# EAGLE design PillEndo-MkI_MAIN5 (EAGLE 6.5.0)
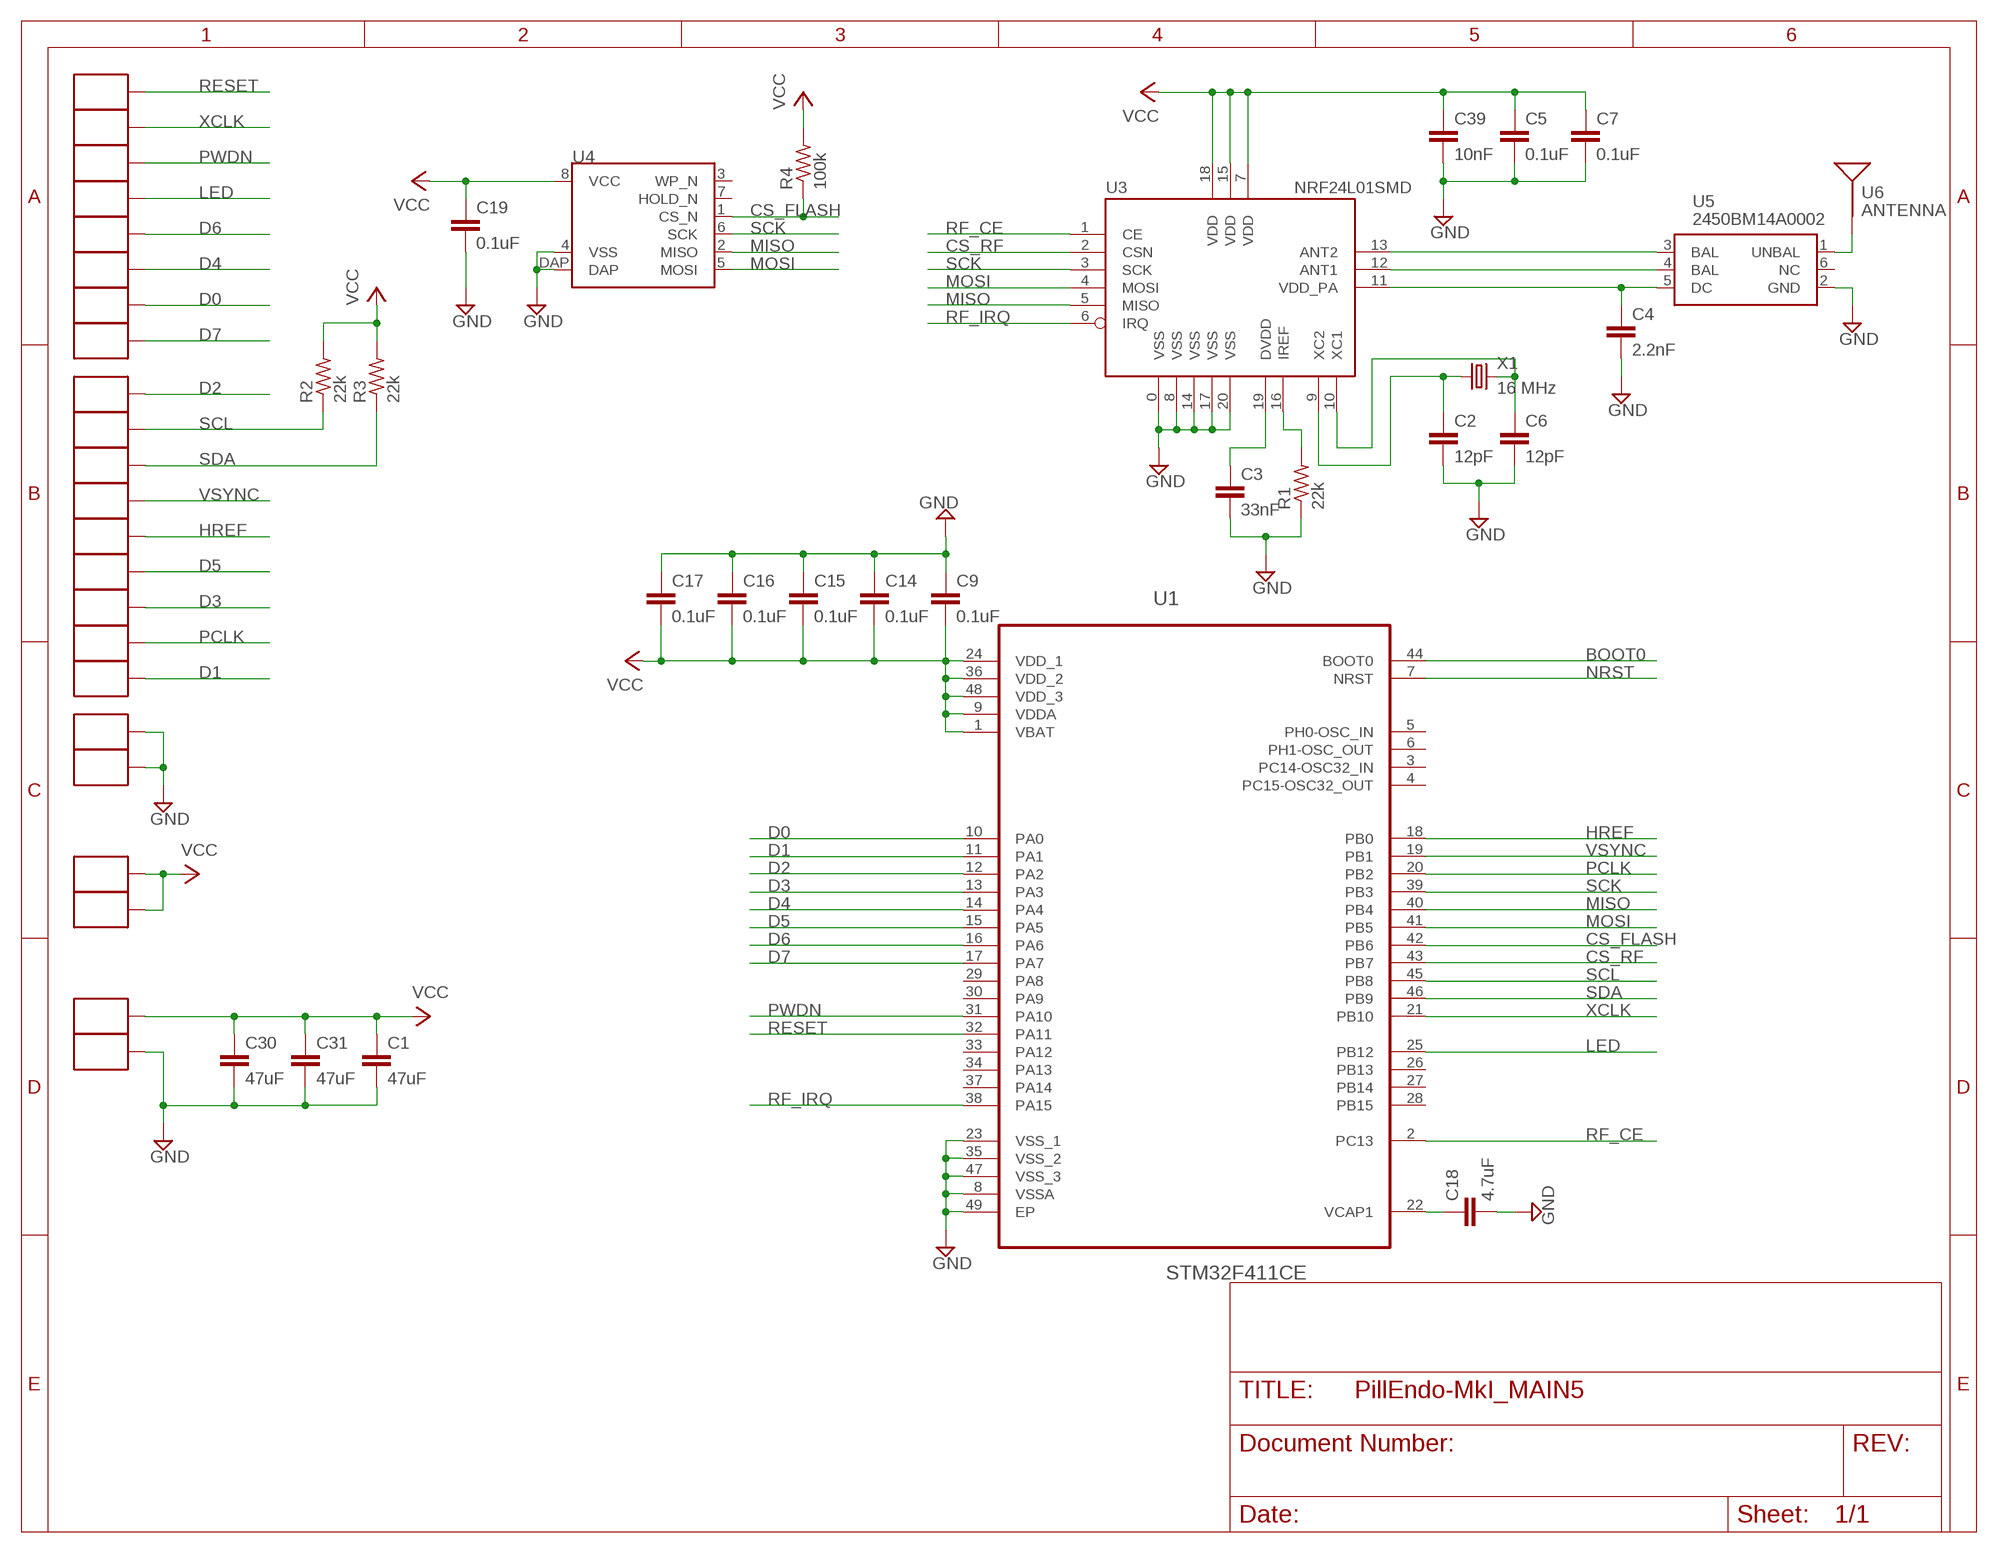
[diagram p0: schematic, sheet 1]

## Parts
C1  47uF  C0603  [C0603]
C2  12pF  C0402  [C0402]
C3  33nF  C0402  [C0402]
C4  2.2nF  C0402  [C0402]
C5  0.1uF  C0402  [C0402]
C6  12pF  C0402  [C0402]
C7  0.1uF  C0402  [C0402]
C9  0.1uF  C0402  [C0402]
C14  0.1uF  C0402  [C0402]
C15  0.1uF  C0402  [C0402]
C16  0.1uF  C0402  [C0402]
C17  0.1uF  C0402  [C0402]
C18  4.7uF  C0402  [C0402]
C19  0.1uF  C0402  [C0402]
C30  47uF  C0603  [C0603]
C31  47uF  C0603  [C0603]
C39  10nF  C0402  [C0402]
R1  22k  R0402  [R0402]
R2  22k  R0402  [R0402]
R3  22k  R0402  [R0402]
R4  100k  R0402  [R0402]
TP1  TP_0.8X1.2  [TP_0.8X1.2]
TP2  TP_0.8X1.2  [TP_0.8X1.2]
TP3  TP_0.8X1.2  [TP_0.8X1.2]
TP4  TP_0.8X1.2  [TP_0.8X1.2]
TP5  TP_0.8X1.2  [TP_0.8X1.2]
TP6  TP_0.8X1.2  [TP_0.8X1.2]
TP7  TP_0.8X1.2  [TP_0.8X1.2]
TP8  TP_0.8X1.2  [TP_0.8X1.2]
TP9  TP_0.8X1.2  [TP_0.8X1.2]
TP10  TP_TP1.0X2.2  [TP_1.0X2.2]
TP11  TP_0.8X1.2  [TP_0.8X1.2]
TP12  TP_TP1.0X2.2  [TP_1.0X2.2]
TP13  TP_0.8X1.2  [TP_0.8X1.2]
TP14  TP_0.8X1.2  [TP_0.8X1.2]
TP15  TP_0.8X1.2  [TP_0.8X1.2]
TP16  TP_0.8X1.2  [TP_0.8X1.2]
TP17  TP_TP1.0X2.2  [TP_1.0X2.2]
TP18  TP_TP1.0X2.2  [TP_1.0X2.2]
TP19  TP_TP1.0X2.2  [TP_1.0X2.2]
TP20  TP_TP1.0X2.2  [TP_1.0X2.2]
TP33  TP_0.8X1.2  [TP_0.8X1.2]
TP34  TP_0.8X1.2  [TP_0.8X1.2]
TP35  TP_0.8X1.2  [TP_0.8X1.2]
U1  STM32F411CE  [QFN50P700X700X60-49N]
U3  NRF24L01SMD  [QFN20]
U4  S25FL256S  [WSON_6X8]
U5  2450BM14A0002  [2450BM14A0002T]
U6  ANTENNA  [2450AT18A100]
X1  16 MHz  CRYSTAL_FA-20H  [CRYSTAL_FA20H]

## Nets
BOOT0: U1.44(BOOT0)
CS_FLASH: R4.1 U1.42(PB6) U4.1(CS_N)
CS_RF: U1.43(PB7) U3.2(CSN)
D0: TP7.P$1 U1.10(PA0)
D1: TP34.P$1 U1.11(PA1)
D2: TP9.P$1 U1.12(PA2)
D3: TP16.P$1 U1.13(PA3)
D4: TP6.P$1 U1.14(PA4)
D5: TP15.P$1 U1.15(PA5)
D6: TP5.P$1 U1.16(PA6)
D7: TP8.P$1 U1.17(PA7)
GND: C1.2 C2.2 C3.2 C4.2 C5.2 C6.2 C7.2 C9.1 C14.1 C15.1 C16.1 C17.1 C18.2 C19.2 C30.2 C31.2 C39.2 R1.1 TP10.P$1 TP12.P$1 TP17.P$1 U1.8(VSSA) U1.23(VSS_1) U1.35(VSS_2) U1.47(VSS_3) U1.49(EP) U3.0(VSS) U3.8(VSS) U3.14(VSS) U3.17(VSS) U3.20(VSS) U4.4(VSS) U4.DAP U5.2(GND)
HREF: TP14.P$1 U1.18(PB0)
LED: TP4.P$1 U1.25(PB12)
MISO: U1.40(PB4) U3.5(MISO) U4.2(MISO)
MOSI: U1.41(PB5) U3.4(MOSI) U4.5(MOSI)
N$1: C3.1 U3.19(DVDD)
N$2: C2.1 U3.9(XC2) X1.1
N$3: C6.1 U3.10(XC1) X1.3
N$4: R1.2 U3.16(IREF)
N$7: C4.1 U3.11(VDD_PA) U5.5(DC)
N$8: U3.12(ANT1) U5.4(BAL)
N$9: U3.13(ANT2) U5.3(BAL)
N$10: U5.1(UNBAL) U6.1(SIGNAL)
N$11: C18.1 U1.22(VCAP1)
NRST: U1.7(NRST)
PCLK: TP33.P$1 U1.20(PB2)
PWDN: TP3.P$1 U1.31(PA10)
RESET: TP1.P$1 U1.32(PA11)
RF_CE: U1.2(PC13) U3.1(CE)
RF_IRQ: U1.38(PA15) U3.6(IRQ)
SCK: U1.39(PB3) U3.3(SCK) U4.6(SCK)
SCL: R2.1 TP11.P$1 U1.45(PB8)
SDA: R3.1 TP35.P$1 U1.46(PB9)
VCC: C1.1 C5.1 C7.1 C9.2 C14.2 C15.2 C16.2 C17.2 C19.1 C30.1 C31.1 C39.1 R2.2 R3.2 R4.2 TP18.P$1 TP19.P$1 TP20.P$1 U1.1(VBAT) U1.9(VDDA) U1.24(VDD_1) U1.36(VDD_2) U1.48(VDD_3) U3.7(VDD) U3.15(VDD) U3.18(VDD) U4.8(VCC)
VSYNC: TP13.P$1 U1.19(PB1)
XCLK: TP2.P$1 U1.21(PB10)
Unconnected: U1.3(PC14-OSC32_IN) U1.4(PC15-OSC32_OUT) U1.5(PH0-OSC_IN) U1.6(PH1-OSC_OUT) U1.26(PB13) U1.27(PB14) U1.28(PB15) U1.29(PA8) U1.30(PA9) U1.33(PA12) U1.34(PA13) U1.37(PA14) U4.3(WP_N) U4.7(HOLD_N) U5.6(NC)

## Library data of the parts
C1 C30 C31 = MSSRP-Lib:C0603
C2-C7 C9 C14-C19 C39 = MSSRP-Lib:C0402
R1-R4 = MSSRP-Lib:R0402
TP1-TP20 TP33-TP35 = MSSRP-Lib:TP
U1 = ST Microelctronics_By_element14_Batch_1:STM32F411CE
U3 = SparkFun-RF:NRF24L01: 2.4GHz Low Power Transceiver This is the very popular, low cost, very low power RF transceiver from Nordic Semiconductor. Simple SPI interface. SKU: COM-00690
U4 = MSSRP-Lib:S25FL256S
U5 = MSSRP-Lib:2450BM14A0002
U6 = RB-MasterLib:ANTENNA
X1 = MSSRP-Lib:CRYSTAL_FA-20H

## Board
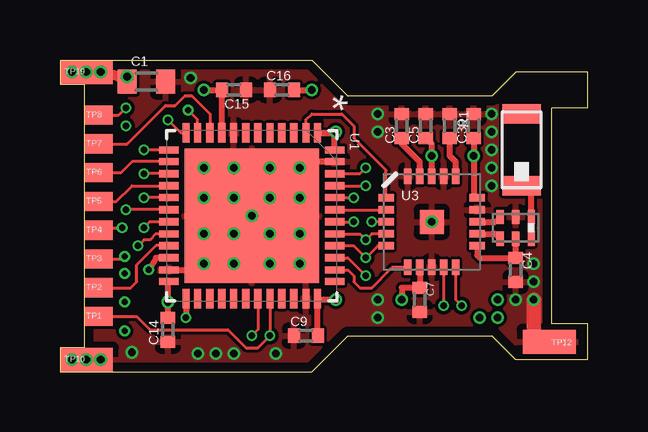
[diagram p1: board, top side]
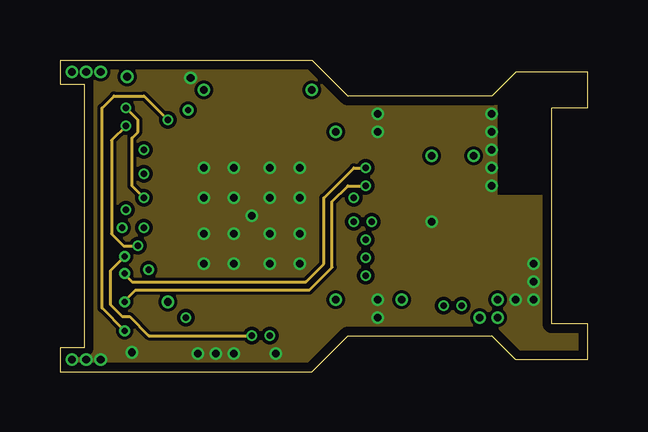
[diagram p2: board, inner layer Route2]
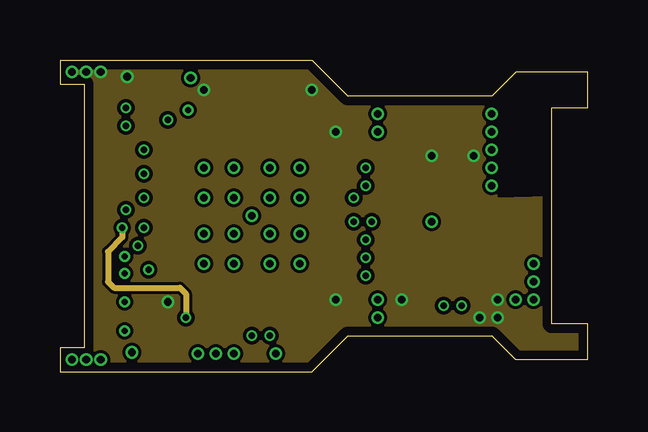
[diagram p3: board, inner layer Route15]
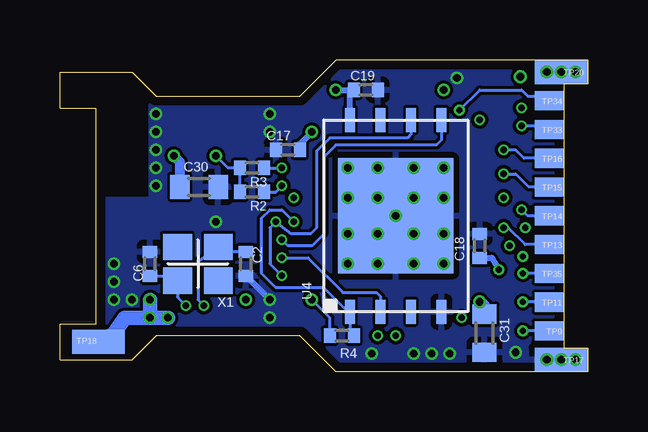
[diagram p4: board, bottom side, seen from below]

Size 22 x 13 mm. Coordinates in mm from the lower left corner, seen from the top.
Outline: 12,1.5 18,1.5 19,0.5 22,0.5 22,2 20.5,2 20.5,11 22,11 22,12.5 19,12.5 18,11.5 12,11.5 10.5,13 0,13 0,12 1,12 1,1 0,1 0,0 10.5,0 12,1.5
Copper layers (1*2*15*16): Top 0.035559375mm / dielectric 0.17018125mm / Route2 0.01778125mm / dielectric 47mil / Route15 0.01778125mm / dielectric 0.17018125mm / Bottom 0.035559375mm
Design rules "OSHPark-4layer": minimum track width 5mil, minimum drill 10mil, track to track 5mil, track to pad 5mil, pad to pad 5mil, via to via 5mil, smd to smd 5mil, copper to edge 15mil, drill to drill 6mil, minimum pad ring 4mil, minimum via ring 4mil, stop-mask expansion 4mil, vias tented up to drill 0mil, thermal gap 10mil

### Footprints (pad centres in the part's own frame; a part is rotated, then mirrored left to right if it is on the bottom)
C0603 = smd 0.8 x 1: 1 -0.8,0; 2 0.8,0
C0402 = smd 0.5 x 0.6: 1 -0.5,0; 2 0.5,0
R0402 = smd 0.5 x 0.6: 1 -0.5,0; 2 0.5,0
TP_0.8X1.2 = smd 1.2 x 0.8: P$1 -0.6,0
TP_1.0X2.2 = smd 2.2 x 1: P$1 -1.1,0
QFN50P700X700X60-49N = smd 0.813 x 0.305: 1 -3.454,2.743; 2 -3.454,2.261; 3 -3.454,1.753; 4 -3.454,1.245; 5 -3.454,0.762; 6 -3.454,0.254; 7 -3.454,-0.254; 8 -3.454,-0.762; 9 -3.454,-1.245; 10 -3.454,-1.753; 11 -3.454,-2.261; 12 -3.454,-2.743; 25 3.454,-2.743; 26 3.454,-2.261; 27 3.454,-1.753; 28 3.454,-1.245; 29 3.454,-0.762; 30 3.454,-0.254; 31 3.454,0.254; 32 3.454,0.762; 33 3.454,1.245; 34 3.454,1.753; 35 3.454,2.261; 36 3.454,2.743 | smd 0.305 x 0.813: 13 -2.743,-3.454; 14 -2.261,-3.454; 15 -1.753,-3.454; 16 -1.245,-3.454; 17 -0.762,-3.454; 18 -0.254,-3.454; 19 0.254,-3.454; 20 0.762,-3.454; 21 1.245,-3.454; 22 1.753,-3.454; 23 2.261,-3.454; 24 2.743,-3.454; 37 2.743,3.454; 38 2.261,3.454; 39 1.753,3.454; 40 1.245,3.454; 41 0.762,3.454; 42 0.254,3.454; 43 -0.254,3.454; 44 -0.762,3.454; 45 -1.245,3.454; 46 -1.753,3.454; 47 -2.261,3.454; 48 -2.743,3.454 | smd 5.588 x 5.588: 49 0,0
QFN20 = smd 1 x 1: 0 0,0 | smd 0.65 x 0.3: 1 -1.9,1; 2 -1.9,0.5; 3 -1.9,0; 4 -1.9,-0.5; 5 -1.9,-1; 11 1.9,-1; 12 1.9,-0.5; 13 1.9,0; 14 1.9,0.5; 15 1.9,1 | smd 0.3 x 0.65: 6 -1,-1.9; 7 -0.5,-1.9; 8 0,-1.9; 9 0.5,-1.9; 10 1,-1.9; 16 1,1.9; 17 0.5,1.9; 18 0,1.9; 19 -0.5,1.9; 20 -1,1.9
WSON_6X8 = smd 0.4 x 1: 1 -1.905,-4; 2 -0.635,-4; 3 0.635,-4; 4 1.905,-4; 5 1.905,4; 6 0.635,4; 7 -0.635,4; 8 -1.905,4 | smd 4.8 x 4.8: DAP 0,0
2450BM14A0002T = smd 0.3 x 0.6: 1 -0.65,-0.45; 2 0,-0.45; 3 0.65,-0.45; 4 0.65,0.45; 5 0,0.45; 6 -0.65,0.45
2450AT18A100 = smd 0.8 x 1.6: 1 -1.5,0; 2 1.5,0
CRYSTAL_FA20H = smd 1.2 x 1.1: 1 -0.85,-0.7; 2 0.85,-0.7; 3 0.85,0.7; 4 -0.85,0.7

### Placement (x,y rotation side)
C1  3.6,12.1 0 top
C2  14.25,4.5 270 bottom
C3  14.25,10.25 90 top
C4  19,4.25 270 top
C5  15.25,10.25 90 top
C6  18.25,4.5 90 bottom
C7  15,3 270 top
C9  10.25,1.5 0 top
C14  4.5,1.75 90 top
C15  7.25,11.75 180 top
C16  9.25,11.75 0 top
C17  12.5,9.25 0 bottom
C18  4.5,5.25 90 bottom
C19  9.25,11.75 0 bottom
C30  16.2,7.7 0 bottom
C31  4.3,1.6 270 bottom
C39  17.25,10.25 90 top
R1  16.25,10.25 270 top
R2  14,7.5 180 bottom
R3  14,8.5 180 bottom
R4  10.25,1.5 180 bottom
TP1  1,2.3 180 top
TP2  1,3.5 180 top
TP3  1,4.7 180 top
TP4  1,5.9 180 top
TP5  1,7.1 180 top
TP6  1,8.3 180 top
TP7  1,9.5 180 top
TP8  1,10.7 180 top
TP9  1,1.7 0 bottom
TP10  0,0.5 180 top
TP11  1,2.9 0 bottom
TP12  21.5,1.25 0 top
TP13  1,5.3 0 bottom
TP14  1,6.5 0 bottom
TP15  1,7.7 0 bottom
TP16  1,8.9 0 bottom
TP17  0,0.5 0 bottom
TP18  21.5,1.25 180 bottom
TP19  0,12.5 180 top
TP20  0,12.5 0 bottom
TP33  1,10.1 0 bottom
TP34  1,11.3 0 bottom
TP35  1,4.1 0 bottom
U1  8,6.5 270 top
U3  15.5,6.25 0 top
U4  8,6.5 0 bottom
U5  19,6 180 top
U6  19.25,9.25 90 top
X1  16.25,4.5 180 bottom

### Tracks (layer width: path | path; a pad name or v marks a point on that pad's centre or on a via)
BOOT0  (via drill 0.25)
  Top 0.127: U1.44 12.24,7.26 v12.25,7.25
CS_FLASH  (via drill 0.25)
  Top 0.127: U1.42 v12.25,6.25
  Bottom 0.127: v12.25,6.25 12.75,6.75 13.25,6.75 13.6,6.4 13.6,4.1 13,3.5 11,3.5 10,2.5 U4.1 9.9,1.66 R4.1
CS_RF
  Top 0.127: U1.43 U3.2
D0
  Top 0.127: TP7.P$1 2.8,9.5 4.4,11.1 4.8,11.1 5.2,11.5 5.5,11.5 6.25,10.75 U1.10
D1  (via drill 0.25)
  Top 0.127: U1.11 5.74,10.51 v5.35,10.9
  Bottom 0.127: v5.35,10.9 4.5,11.75 2.75,11.75 2.5,11.5 1.8,11.5 TP34.P$1
D2  (via drill 0.25)
  Top 0.127: U1.12 5.05,9.95 v4.5,10.5
  Route2 0.127: v2.7,1.7 1.75,2.65 1.75,11 2.25,11.5 3.5,11.5 v4.5,10.5
  Bottom 0.127: TP9.P$1 v2.7,1.7
D3  (via drill 0.25)
  Top 0.127: U1.13 v3.51,9.24 v3.5,9.25
  Bottom 0.127: TP16.P$1 2.65,8.9 3,9.25 v3.5,9.25
D4
  Top 0.127: TP6.P$1 2.55,8.3 3.01,8.76 U1.14
D5  (via drill 0.25)
  Top 0.127: U1.15 v3.5,8.25
  Bottom 0.127: TP15.P$1 2.45,7.7 2.88,8.12 3,8.25 v3.5,8.25
D6
  Top 0.127: TP5.P$1 2.35,7.1 3,7.75 U1.16
D7  (via drill 0.25)
  Top 0.127: U1.17 3.51,7.26 v3.5,7.25 | TP8.P$1 2.45,10.7 v2.75,11
  Route2 0.127: 3.51,7.26 3.49,7.26 3,7.75 3,9.75 3.25,10 3.25,10.5 v2.75,11
  Route2 0.406: 3.51,7.26 3.5,7.26 v3.5,7.25
GND  (via drill 0.33)
  Top 0.127: TP17.P$1 v1.7,0.5 | U1.49 8.7,7.2 8.7,8.5 8,7.8 U1.49
  Top 0.254: U1.47 10.26,8.76 arc90 v10,8.5 | U1.23 5.74,4.24 v6,4.5
  Top 0.61: TP12.P$1 19.75,1.3 v19.75,3
  Bottom 0.254: C2.2 v13.25,3
  other vias: 15.5,6.25 10,7.25 8.75,8.5 8.75,7.25 7.25,7.25 7.25,8.5 10,5.75 6,8.5 6,7.25 10,4.5 6,5.75 7.25,5.75 18,10.75 18,10 18,9.25 18,8.5 18,7.75 13.25,10.75 13.25,10 13.25,2.25 7.25,4.5 8.75,4.5 8.75,5.75 19,3 19.75,3.75 19.75,4.5 5.45,12.25 9,0.75 7.25,0.75 6.5,0.75 5.75,0.75 8,6.5 3,0.8 1.1,0.5 0.5,0.5
  pour Bottom (isolate 0.127, rank 6): 0,0 22,0 22,7.25 18.25,7.25 18.25,13 0,13
  pour Top (isolate 0.127, rank 6): 0,0 22,0 22,7.25 18.25,7.25 18.25,13 0,13
  pour Route2 (isolate 0.127, rank 6): 0,13 0,0 22,0 22,7.3 18.2,7.3 18.2,13
HREF  (via drill 0.25)
  Top 0.127: U1.18 v2.75,6.75
  Bottom 0.127: TP14.P$1 2.5,6.5 v2.75,6.75
LED  (via drill 0.25)
  Top 0.127: TP4.P$1 1.7,6 v2.6,6
  Top 0.254: U1.25 v5.26,2.24 v5.25,2.25
  Route15 0.254: v2.6,6 2.6,5.6 2,5 2,3.75 2.25,3.5 5,3.5 5.25,3.25 v5.25,2.25
MISO  (via drill 0.25)
  Top 0.127: U3.5 13.25,5.25 v12.75,4.75 12.24,5.25 U1.40
  Bottom 0.127: v12.75,4.75 11.65,4.75 10.2,3.3 8.8,3.3 8.63,3.13 U4.2
MOSI  (via drill 0.25)
  Top 0.127: U1.41 12.51,5.74 v12.75,5.5 13,5.75 U3.4
  Bottom 0.127: U4.5 6.09,9.65 6.3,9.45 10.5,9.45 11,8.95 11,5.75 11.5,5.25 12.5,5.25 v12.75,5.5
N$1
  Top 0.254: U3.19 15,8.75 14.25,9.5 C3.1
N$2  (via drill 0.25)
  Top 0.127: v16,2.75 U3.9
  Bottom 0.127: v16,2.75 16.25,3 16.25,4.6 X1.1 15.2,5 C2.1
N$3  (via drill 0.25)
  Top 0.127: v16.75,2.75 16.5,3 U3.10
  Bottom 0.127: v16.75,2.75 17.1,3.1 X1.3 17.3,4 C6.1
N$4
  Top 0.254: U3.16 16.5,8.75 16.25,9 R1.2
N$7
  Top 0.254: U5.5 C4.1 17.5,4.75 17.4,4.85 U3.11
N$8
  Top 0.254: U3.12 18.15,5.75 U5.4
N$9
  Top 0.254: U3.13 18.15,6.25 U5.3
N$10
  Top 0.254: U5.1 19.65,7.75 U6.1
N$11  (via drill 0.25)
  Top 0.254: U1.22 4,4.75 v3.7,4.25
  Bottom 0.254: C18.1 4,4.75 v3.7,4.25
PCLK  (via drill 0.25)
  Top 0.127: U1.20 3.99,5.74 3.75,5.5 3.5,5.5 v3.25,5.25
  Route2 0.127: v2.75,10.25 2.15,9.65 2.15,5.75 2.65,5.25 v3.25,5.25
  Bottom 0.127: TP33.P$1 1.6,10.25 v2.75,10.25
PWDN  (via drill 0.25)
  Top 0.127: TP3.P$1 2.6,4.7 v2.7,4.8 | U1.31 8.25,1.75 v8,1.5
  Route2 0.127: v2.7,4.8 2.1,4.2 2.1,2.8 2.6,2.3 2.9,2.3 3.7,1.5 v8,1.5
RESET  (via drill 0.25)
  Top 0.127: U1.32 8.75,3.03 v8.75,1.5 8.25,1 7.75,1 7,1.75 3.75,1.75 3.2,2.3 TP1.P$1
RF_CE
  Top 0.127: U3.1 13.6,8.4 12.25,9.75 12.25,10.25 11.75,10.75 10.5,10.75 10.26,10.51 U1.2
RF_IRQ
  Top 0.127: U1.38 12.01,4.24 12.25,4 12.25,3.75 12.5,3.5 13,3.5 13.85,4.35 U3.6
SCK  (via drill 0.25)
  Top 0.127: U3.3 v13,6.25 | U1.39 12,4.75 v12.75,4
  Bottom 0.127: v12.75,4 13.25,4.5 13.25,6 v13,6.25 12.35,5.75 11.55,5.75 11.3,6 11.3,9.2 10.75,9.75 7.5,9.75 7.37,9.88 U4.6
SCL  (via drill 0.25)
  Top 0.127: U1.45 v12.74,7.75 v12.75,7.75
  Route2 0.127: v2.7,2.9 2.7,2.95 3.15,3.4 10.4,3.4 11.35,4.35 11.35,7.1 12,7.75 v12.75,7.75
  Bottom 0.127: R2.1 13,7.5 v12.75,7.75 | TP11.P$1 v2.7,2.9
SDA  (via drill 0.25)
  Top 0.127: U1.46 12.5,8.25 v12.75,8.5
  Route2 0.127: v2.7,4.1 2.7,4.05 3,3.75 10.25,3.75 11,4.5 11,7.25 12.25,8.5 v12.75,8.5
  Bottom 0.127: R3.1 v12.75,8.5 | TP35.P$1 v2.7,4.1
VCC  (via drill 0.33)
  Top 0.127: TP19.P$1 1.65,12.5
  Top 0.254: U3.7 C7.1 14.25,3.5 v14.25,3 | U3.18 v15.5,9 15.5,9.5 C5.1 | C39.1 v17.25,9 17.25,7.25 U3.15 | v11.5,3 10.79,3 U1.36 R4.2 | U1.9 C15.2 v6,11.75 | C14.2 v4.5,2.9 4.5,3.71 U1.24 | U1.1 11.45,9.95 | U1.48 11.45,9.95 | 11.45,9.95 v11.5,10 | C16.2 v10.5,11.75
  Top 0.406: 1.65,12.5 arc-29 C1.1
  Bottom 0.127: R2.2 R3.2 15,8.5 v15.5,9 | U4.8 9.9,10.75 | TP19.P$1 1.65,12.5 | R4.2 10.75,2.25 v11.5,3
  Bottom 0.254: C17.2 12,9.5 v11.5,10 | 9.9,10.75 9.9,11.6 C16.2 v10.5,11.75
  Bottom 0.406: C30.1 17,8.75 v17.25,9 | C31.1 4.3,2.8 v4.5,2.9
  Bottom 0.61: v18.25,3 v18.25,2.25 | v17.5,2.25 v18.25,2.25 | TP18.P$1 19.75,1.6 19.3,2.25 v18.25,2.25
  other vias: 0.5,12.5 2.8,12.3 1.1,12.5 1.7,12.5
  pour Route15 (rank 6): 0,0 22,0.1 22,7.3 18.2,7.2 18.2,13 0,13
VSYNC  (via drill 0.25)
  Top 0.127: U1.19 3.75,6.25 v3.5,6
  Bottom 0.127: TP13.P$1 2.6,5.3 3.3,6 v3.5,6
XCLK
  Top 0.127: U1.21 4,5.25 3.2,4.45 3.2,3.75 2.95,3.5 TP2.P$1